# EAGLE design i2c-expander-40 (EAGLE 7.5.0)
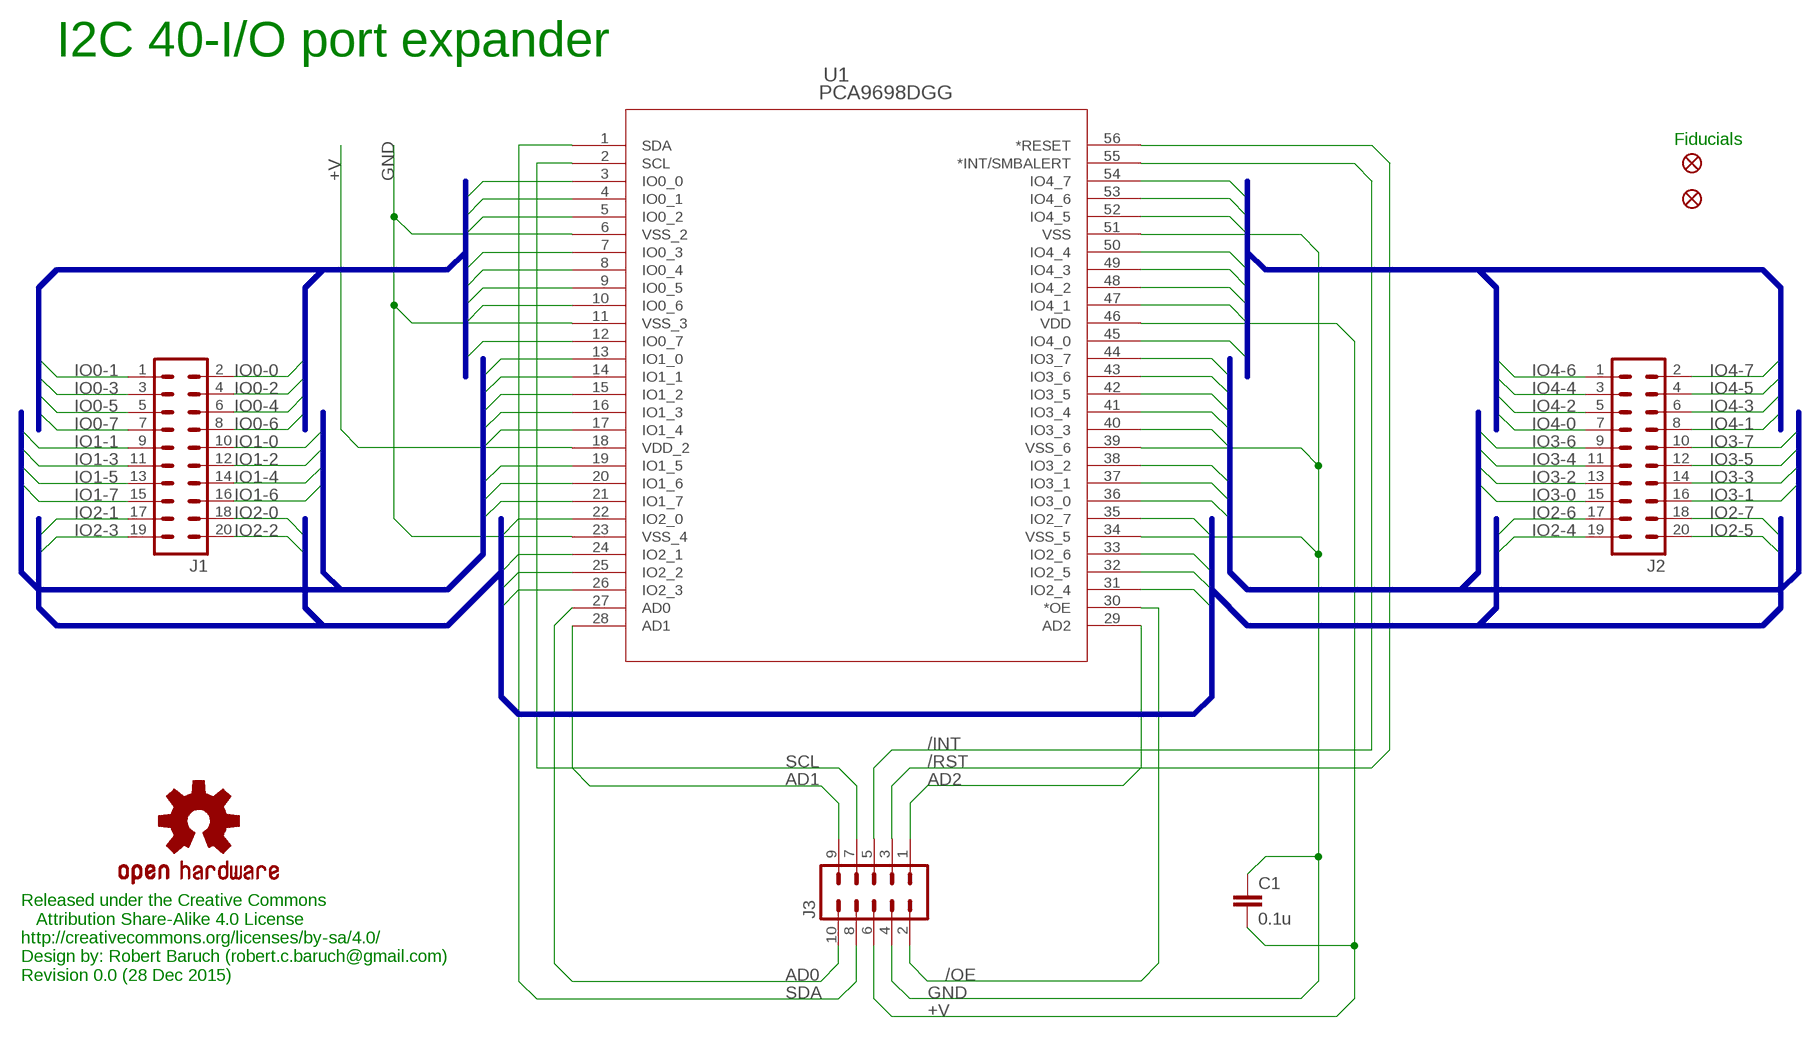
[diagram p0: schematic, sheet 1]

## Parts
C1  0.1u  C-EUC0805K  [C0805K]
FID1  FIDUCIAL1X2  [FIDUCIAL-1X2]
FID2  FIDUCIAL1X2  [FIDUCIAL-1X2]
J1  MA10-2  [MA10-2]
J2  MA10-2  [MA10-2]
J3  MA05-2  [MA05-2]
LOGO1  OSHW-LOGOS  [OSHW-LOGO-S]
U1  PCA9698DGG  [SOT364-1]

## Nets
+V: C1.2 J3.6 U1.18(VDD_2) U1.46(VDD)
/INT: J3.5 U1.55(*INT/SMBALERT)
/OE: J3.2 U1.30(*OE)
/RST: J3.3 U1.56(*RESET)
AD0: J3.10 U1.27(AD0)
AD1: J3.9 U1.28(AD1)
AD2: J3.1 U1.29(AD2)
GND: C1.1 J3.4 U1.6(VSS_2) U1.11(VSS_3) U1.23(VSS_4) U1.34(VSS_5) U1.39(VSS_6) U1.51(VSS)
IO0-0: J1.2 U1.3(IO0_0)
IO0-1: J1.1 U1.4(IO0_1)
IO0-2: J1.4 U1.5(IO0_2)
IO0-3: J1.3 U1.7(IO0_3)
IO0-4: J1.6 U1.8(IO0_4)
IO0-5: J1.5 U1.9(IO0_5)
IO0-6: J1.8 U1.10(IO0_6)
IO0-7: J1.7 U1.12(IO0_7)
IO1-0: J1.10 U1.13(IO1_0)
IO1-1: J1.9 U1.14(IO1_1)
IO1-2: J1.12 U1.15(IO1_2)
IO1-3: J1.11 U1.16(IO1_3)
IO1-4: J1.14 U1.17(IO1_4)
IO1-5: J1.13 U1.19(IO1_5)
IO1-6: J1.16 U1.20(IO1_6)
IO1-7: J1.15 U1.21(IO1_7)
IO2-0: J1.18 U1.22(IO2_0)
IO2-1: J1.17 U1.24(IO2_1)
IO2-2: J1.20 U1.25(IO2_2)
IO2-3: J1.19 U1.26(IO2_3)
IO2-4: J2.19 U1.31(IO2_4)
IO2-5: J2.20 U1.32(IO2_5)
IO2-6: J2.17 U1.33(IO2_6)
IO2-7: J2.18 U1.35(IO2_7)
IO3-0: J2.15 U1.36(IO3_0)
IO3-1: J2.16 U1.37(IO3_1)
IO3-2: J2.13 U1.38(IO3_2)
IO3-3: J2.14 U1.40(IO3_3)
IO3-4: J2.11 U1.41(IO3_4)
IO3-5: J2.12 U1.42(IO3_5)
IO3-6: J2.9 U1.43(IO3_6)
IO3-7: J2.10 U1.44(IO3_7)
IO4-0: J2.7 U1.45(IO4_0)
IO4-1: J2.8 U1.47(IO4_1)
IO4-2: J2.5 U1.48(IO4_2)
IO4-3: J2.6 U1.49(IO4_3)
IO4-4: J2.3 U1.50(IO4_4)
IO4-5: J2.4 U1.52(IO4_5)
IO4-6: J2.1 U1.53(IO4_6)
IO4-7: J2.2 U1.54(IO4_7)
SCL: J3.7 U1.2(SCL)
SDA: J3.8 U1.1(SDA)

## Buses
IO0-[0..7]
IO1-[0..7]
IO2-[0..7]
IO3-[0..7]
IO4-[0..7]

## Notes on the sheet
- I2C 40-I/O port expander
- Fiducials
- Released under the Creative Commons 
     Attribution Share-Alike 4.0 License
  http://creativecommons.org/licenses/by-sa/4.0/
  Design by: Robert Baruch (robert.c.baruch@gmail.com)
  Revision 0.0 (28 Dec 2015)

## Library data of the parts
C1 = rcl:C-EU: CAPACITOR, European symbol
FID1 FID2 = SparkFun-Aesthetics:FIDUCIAL: Fiducial Alignment Points Various fiducial points for machine vision alignment.
J1 J2 = con-lstb:MA10-2: PIN HEADER; OC_FARNELL: unknown; OC_NEWARK: unknown
J3 = con-lstb:MA05-2: PIN HEADER; OC_FARNELL: unknown; OC_NEWARK: unknown
LOGO1 = SparkFun-Aesthetics:OSHW-LOGO: Open Source Hardware Logo This logo indicates the piece of hardware it is found on incorporates a OSHW license and/or adheres to the definition of open source hardware found here: http://freedomdefined.org/OSHW
U1 = nxp:PCA9698DGG: I2C 40 I/O expander; COPYRIGHT: Copyright (C) 2015 Accelerated Designs. All rights reserved; MANUFACTURER_PART_NUMBER: PCA9698DGG; VENDOR: NXP

## Board
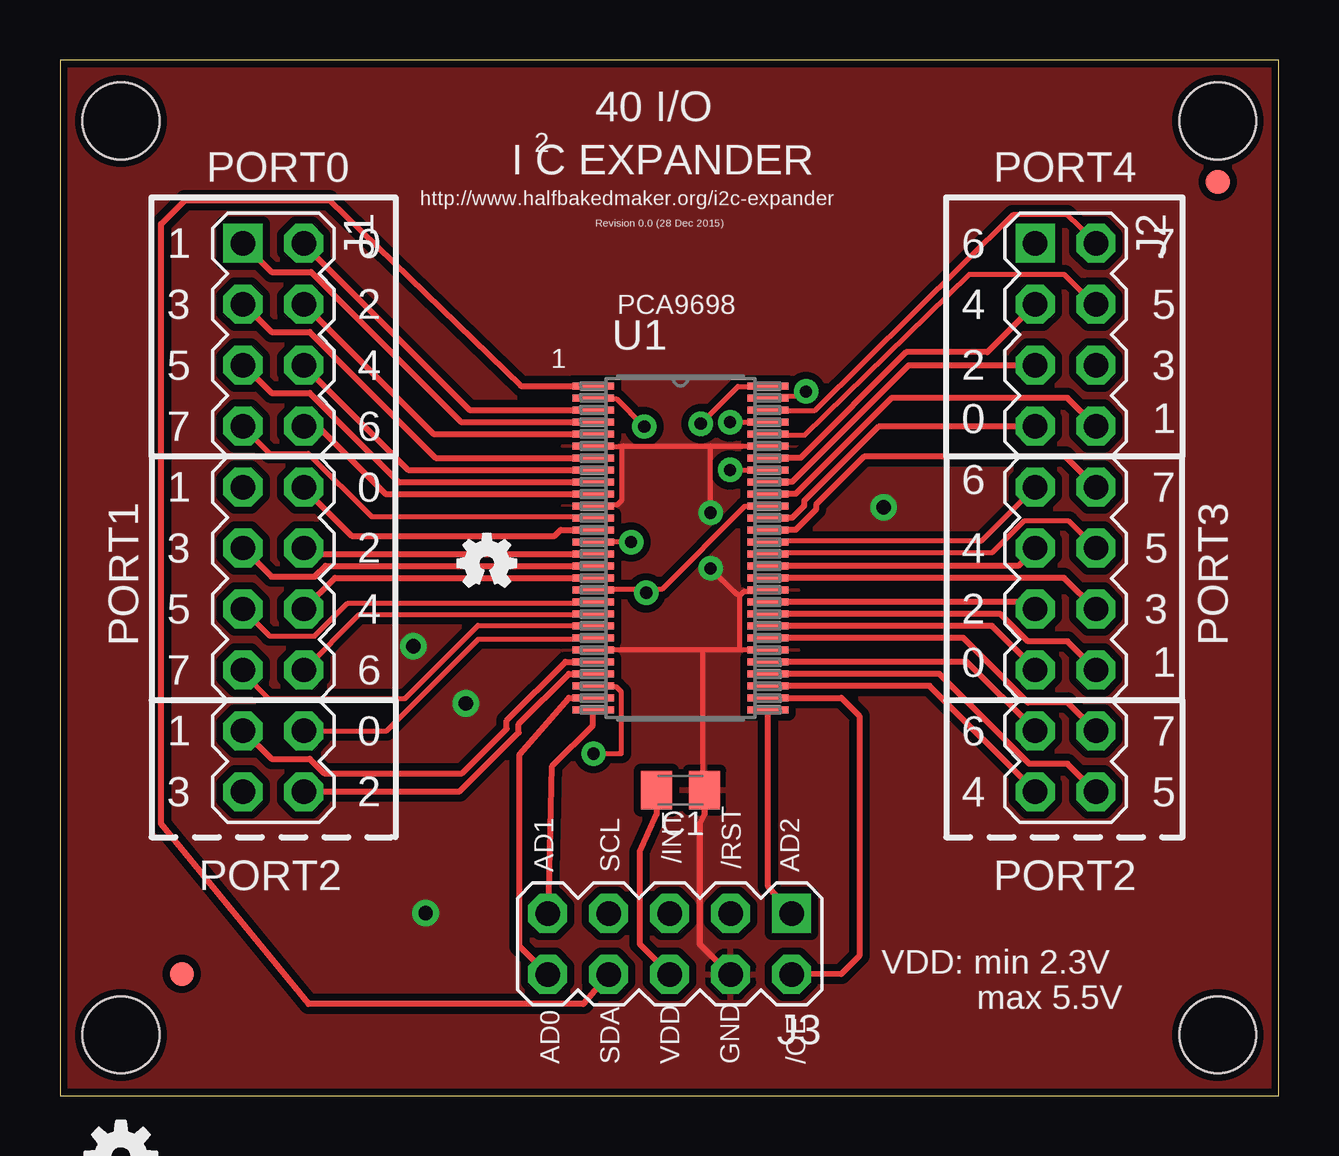
[diagram p1: board, top side]
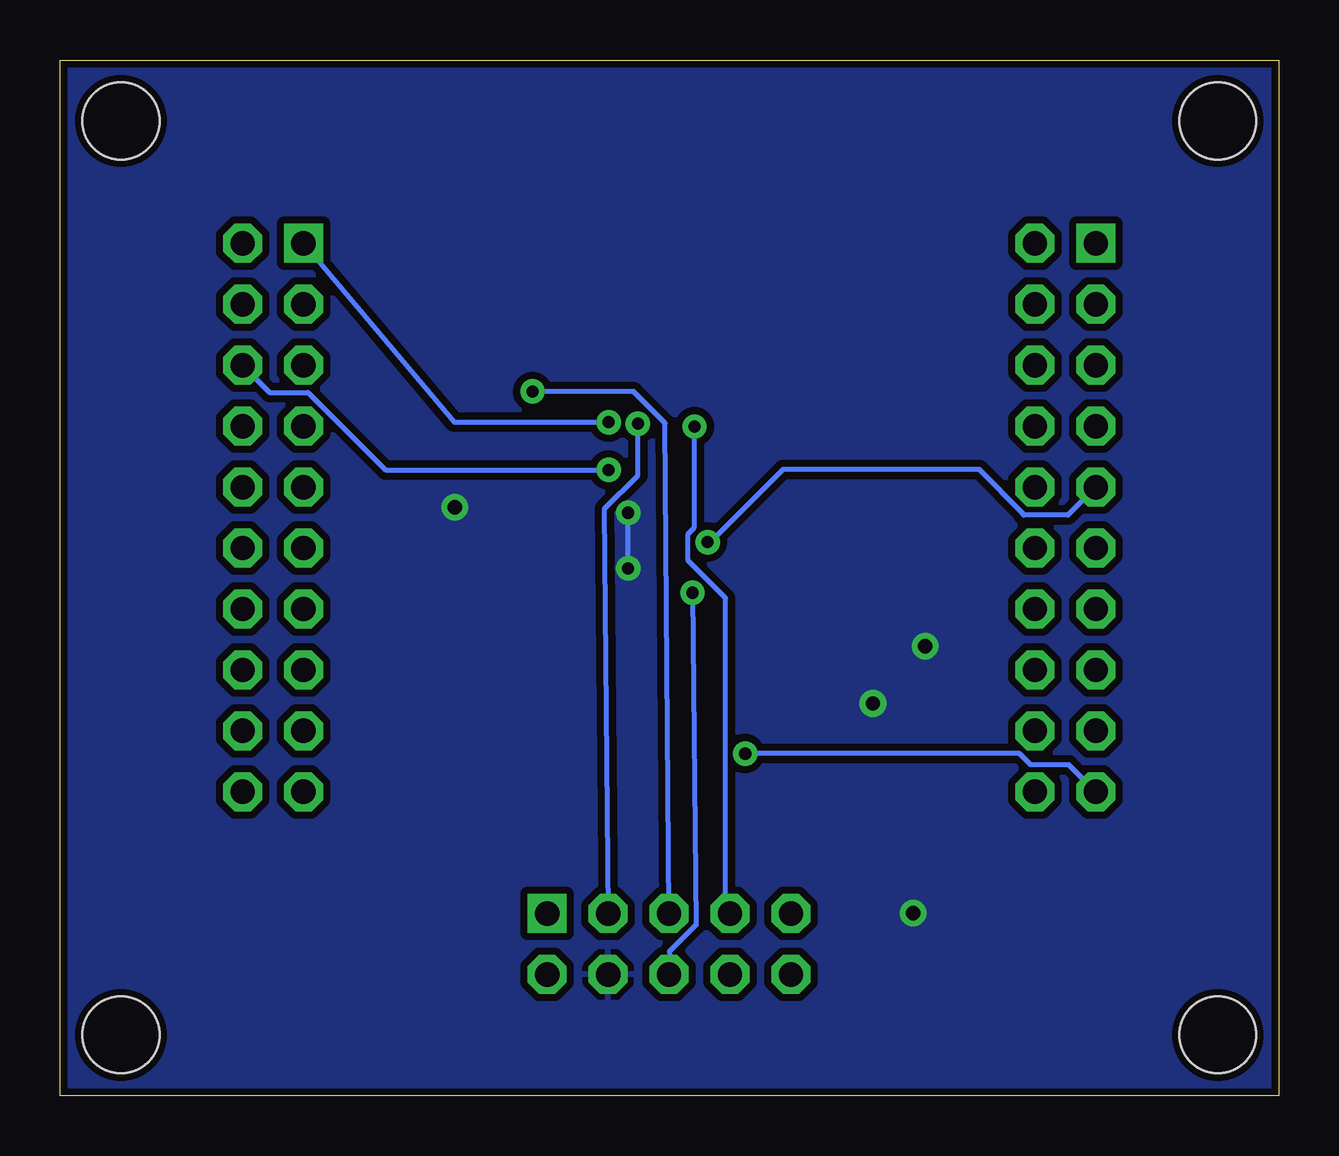
[diagram p2: board, bottom side, seen from below]

Size 50.8 x 43.18 mm. Coordinates in mm from the lower left corner, seen from the top.
Outline: 0,0 50.8,0 50.8,43.18 0,43.18 0,0
Copper layers (1*16): Top 0.035mm / dielectric 1.5mm / Bottom 0.035mm
Design rules "SparkFun": minimum track width 8mil, minimum drill 20mil, track to track 8mil, track to pad 8mil, pad to pad 8mil, via to via 8mil, smd to smd 8mil, copper to edge 10mil, drill to drill 8mil, minimum pad ring 12mil, minimum via ring 10mil, stop-mask expansion 4mil, vias tented up to drill 25mil, thermal gap 10mil
Holes 3.2 mm at 2.54,40.64 48.26,40.64 48.26,2.54 2.54,2.54

### Footprints (pad centres in the part's own frame; a part is rotated, then mirrored left to right if it is on the bottom)
C0805K = smd 1.3 x 1.6: 1 -1,0; 2 1,0
FIDUCIAL-1X2 = smd 1 x 1: 1 0,0
MA10-2 = drill 1.016 square: 1 -11.43,-1.27 | drill 1.016 octagon: 2 -11.43,1.27; 3 -8.89,-1.27; 4 -8.89,1.27; 5 -6.35,-1.27; 6 -6.35,1.27; 7 -3.81,-1.27; 8 -3.81,1.27; 9 -1.27,-1.27; 10 -1.27,1.27; 11 1.27,-1.27; 12 1.27,1.27; 13 3.81,-1.27; 14 3.81,1.27; 15 6.35,-1.27; 16 6.35,1.27; 17 8.89,-1.27; 18 8.89,1.27; 19 11.43,-1.27; 20 11.43,1.27
MA05-2 = drill 1.016 square: 1 -5.08,-1.27 | drill 1.016 octagon: 2 -5.08,1.27; 3 -2.54,-1.27; 4 -2.54,1.27; 5 0,-1.27; 6 0,1.27; 7 2.54,-1.27; 8 2.54,1.27; 9 5.08,-1.27; 10 5.08,1.27
SOT364-1 = smd 1.727 x 0.279: 1 -3.645,6.75; 2 -3.645,6.25; 3 -3.645,5.75; 4 -3.645,5.25; 5 -3.645,4.75; 6 -3.645,4.25; 7 -3.645,3.75; 8 -3.645,3.25; 9 -3.645,2.75; 10 -3.645,2.25; 11 -3.645,1.75; 12 -3.645,1.25; 13 -3.645,0.75; 14 -3.645,0.25; 15 -3.645,-0.25; 16 -3.645,-0.75; 17 -3.645,-1.25; 18 -3.645,-1.75; 19 -3.645,-2.25; 20 -3.645,-2.75; 21 -3.645,-3.25; 22 -3.645,-3.75; 23 -3.645,-4.25; 24 -3.645,-4.75; 25 -3.645,-5.25; 26 -3.645,-5.75; 27 -3.645,-6.25; 28 -3.645,-6.75; 29 3.645,-6.75; 30 3.645,-6.25; 31 3.645,-5.75; 32 3.645,-5.25; 33 3.645,-4.75; 34 3.645,-4.25; 35 3.645,-3.75; 36 3.645,-3.25; 37 3.645,-2.75; 38 3.645,-2.25; 39 3.645,-1.75; 40 3.645,-1.25; 41 3.645,-0.75; 42 3.645,-0.25; 43 3.645,0.25; 44 3.645,0.75; 45 3.645,1.25; 46 3.645,1.75; 47 3.645,2.25; 48 3.645,2.75; 49 3.645,3.25; 50 3.645,3.75; 51 3.645,4.25; 52 3.645,4.75; 53 3.645,5.25; 54 3.645,5.75; 55 3.645,6.25; 56 3.645,6.75

### Placement (x,y rotation side)
C1  25.87,12.74 180 top
FID1  5.08,5.08 0 top
FID2  48.26,38.1 0 top
J1  8.9,24.1 270 top
J2  41.92,24.1 270 top
J3  25.41,6.33 180 top
LOGO1  2.54,-2.54 0 top
U1  25.87,22.83 0 top
U$1  [OSHW-LOGO-MINI]  17.79,22.21 0 top

### Tracks (layer width: path | path; a pad name or v marks a point on that pad's centre or on a via)
+V  (via drill 0.51)
  Top 0.203: 24.43,21.11 25.09,21.11 28.54,24.57 29.49,24.57 U1.46 | 24.43,21.11 22.26,21.11 22.24,21.09 U1.18 | v24.43,20.97 24.43,21.11
  Top 0.254: C1.2 24.86,11.74 24.16,10.18 24.16,6.33 25.41,5.08 J3.6
  Bottom 0.203: v24.43,20.97 24.28,7.13 25.4,6.01 J3.6
/INT  (via drill 0.51)
  Top 0.203: v31.1,29.36 30.88,29.14 29.55,29.14 29.52,29.1 U1.55
  Bottom 0.203: v31.1,29.36 26.89,29.36 25.57,28.04 J3.5
/OE
  Top 0.254: U1.30 32.56,16.59 33.31,15.85 33.31,5.83 32.56,5.08 J3.2
/RST  (via drill 0.51)
  Top 0.203: v26.71,28.02 28.25,29.57 29.49,29.57 U1.56
  Bottom 0.203: v26.71,28.02 26.71,25.87 28.09,24.49 J3.3
AD0
  Top 0.254: J3.10 19.16,6.23 19.16,14.24 21.21,16.59 22.21,16.59 U1.27
AD1
  Top 0.254: U1.28 22.21,16.05 22.21,15.45 20.52,13.74 20.36,7.63 J3.9
AD2
  Top 0.254: J3.1 29.52,8.73 29.52,16.05 U1.29
GND  (via drill 0.51, 0.6)
  Top 0.203: 23.4,27.07 23.4,24.81 23.22,24.63 22.28,24.63 22.24,24.59 U1.11 | 23.4,27.07 22.24,27.07 U1.6 | 27.12,27.09 23.48,27.09 23.4,27.07 | 27.12,27.09 29.49,27.09 U1.51 | 28.34,18.59 29.49,18.59 U1.34 | 28.34,18.59 26.81,18.59 | 26.81,18.59 22.24,18.59 U1.23 | 28.34,20.85 28.52,21.03 29.45,21.03 29.49,21.07 U1.39 | 28.34,18.59 28.34,20.85 | 26.81,18.59 26.81,12.86 C1.1 | v27.12,24.3 27.12,27.09 | v27.12,21.99 28.19,20.91 28.25,20.91 28.34,20.85
  Top 0.254: C1.1 26.86,11.74 26.66,11.34 26.66,6.33 27.91,5.08 J3.4
  Bottom 0.203: v27.12,21.99 v27.12,24.3
  other vias: 15.24,7.62 16.92,16.36 14.73,18.75 34.34,24.54
  pour Top (isolate 0.305): 0,43.18 50.8,43.18 50.8,0 0,0
  pour Bottom (isolate 0.305): 0,43.18 50.8,43.18 50.8,0 0,0
IO0-0
  Top 0.254: U1.3 22.21,28.59 17.07,28.59 10.16,35.49 J1.2
IO0-1
  Top 0.254: J1.1 8.81,34.34 10.46,34.34 16.71,28.09 22.21,28.09 U1.4
IO0-2
  Top 0.254: J1.4 15.56,27.59 22.21,27.59 U1.5
IO0-3
  Top 0.254: U1.7 22.21,26.59 15.66,26.59 10.41,31.84 8.81,31.84 7.67,32.99 J1.3
IO0-4
  Top 0.254: U1.8 22.21,26.09 14.52,26.09 J1.6
IO0-5
  Top 0.254: U1.9 22.21,25.59 14.12,25.59 10.41,29.3 8.81,29.3 7.67,30.45 J1.5
IO0-6
  Top 0.254: U1.10 22.21,25.09 13.56,25.09 10.77,27.89 10.16,27.89 J1.8
IO0-7
  Top 0.203: U1.12 22.22,24.1 22.18,24.14 12.99,24.14 10.35,26.78 8.75,26.78 J1.7
IO1-0
  Top 0.254: U1.13 22.21,23.59 20.86,23.59 20.61,23.34 12.16,23.34 10.16,25.34 J1.10
IO1-1  (via drill 0.51)
  Top 0.203: v23.8,23.08 22.24,23.08 U1.14
  Bottom 0.203: v23.8,23.08 23.68,23.08 20.66,26.11 12.49,26.11 10.66,24.28 10.66,24.22 10.64,24.2 8.79,24.2 J1.9
IO1-2
  Top 0.254: U1.15 22.21,22.59 10.37,22.59 10.16,22.8 J1.12
IO1-3
  Top 0.254: J1.11 8.81,21.64 10.62,21.64 11.06,22.09 22.21,22.09 U1.16
IO1-4
  Top 0.254: J1.14 11.46,21.59 22.21,21.59 U1.17
IO1-5
  Top 0.203: U1.19 22.18,20.54 12,20.54 10.62,19.16 8.75,19.16 J1.13
IO1-6
  Top 0.203: U1.20 22.2,20.06 12.47,20.06 J1.16
IO1-7
  Top 0.203: U1.21 22.1,19.61 17.42,19.61 14.38,16.56 8.69,16.56 7.67,17.58 J1.15
IO2-0
  Top 0.203: U1.22 22.18,19.04 17.45,19.04 13.62,15.22 J1.18
IO2-1
  Top 0.254: U1.24 22.21,18.09 21.07,18.09 18.61,15.64 18.61,15.29 16.77,13.45 11.02,13.45 10.41,14.04 8.81,14.04 7.67,15.2 J1.17
IO2-2
  Top 0.254: U1.25 22.21,17.59 21.21,17.59 19.11,15.49 19.11,15.14 16.66,12.7 10.16,12.7 J1.20
IO2-3  (via drill 0.51)
  Top 0.203: v22.24,14.27 23.4,14.27 23.4,16.84 23.2,17.05 22.26,17.05 22.24,17.07 U1.26
  Bottom 0.203: v22.24,14.27 10.8,14.27 10.33,13.8 8.75,13.8 J1.19
IO2-4
  Top 0.254: U1.31 29.52,17.09 36.25,17.09 40.65,12.7 J2.19
IO2-5
  Top 0.254: U1.32 29.52,17.59 36.65,17.59 40.4,13.85 42,13.85 43.15,12.7 J2.20
IO2-6
  Top 0.254: U1.33 29.52,18.09 37.8,18.09 40.65,15.24 J2.17
IO2-7
  Top 0.254: U1.35 29.52,19.09 37.65,19.09 40.35,16.39 42,16.39 43.15,15.24 J2.18
IO3-0
  Top 0.254: U1.36 29.52,19.59 38.85,19.59 40.65,17.8 J2.15
IO3-1
  Top 0.254: J2.16 42,18.95 40.35,18.95 39.2,20.09 29.52,20.09 U1.37
IO3-2
  Top 0.254: J2.13 40.35,20.59 29.52,20.59 U1.38
IO3-3
  Top 0.254: U1.40 29.52,21.59 41.85,21.59 43.15,20.3 J2.14
IO3-4
  Top 0.254: U1.41 29.52,22.09 39.95,22.09 40.65,22.8 J2.11
IO3-5
  Top 0.203: U1.42 29.52,22.6 29.55,22.64 38.85,22.64 40.17,23.96 42.06,23.96 J2.12
IO3-6
  Top 0.203: U1.43 29.52,23.1 29.54,23.12 38.41,23.12 J2.9
IO3-7
  Top 0.254: U1.44 29.52,23.59 30.66,23.59 31.52,24.45 31.52,24.64 33.52,26.64 41.9,26.64 43.15,25.39 J2.10
IO4-0
  Top 0.254: U1.45 29.52,24.09 30.52,24.09 31.02,24.59 31.02,24.8 34.12,27.89 40.65,27.89 J2.7
IO4-1
  Top 0.254: U1.47 29.52,25.09 30.66,25.09 34.66,29.09 42,29.09 43.15,27.95 J2.8
IO4-2
  Top 0.254: U1.48 29.52,25.59 30.52,25.59 35.37,30.45 J2.5
IO4-3  (via drill 0.51)
  Top 0.203: v27.93,26.09 29.49,26.09 U1.49
  Bottom 0.203: v27.93,26.09 37.23,26.09 40.46,29.32 42.06,29.32 J2.6
IO4-4
  Top 0.254: J2.3 38.65,31 35.27,31 30.86,26.59 29.52,26.59 U1.50
IO4-5
  Top 0.203: U1.52 29.62,27.53 31.04,27.53 37.9,34.24 41.86,34.24 43.08,33.02 J2.4
IO4-6  (via drill 0.51)
  Top 0.203: v27.93,28.08 29.49,28.08 U1.53
  Bottom 0.203: v27.93,28.08 34.37,28.08 40.64,35.52 J2.1
IO4-7
  Top 0.203: U1.54 29.62,28.55 31.45,28.55 39.73,36.73 41.96,36.73 43.08,35.66 J2.2
SCL  (via drill 0.51)
  Top 0.203: v24.35,27.9 23.22,29.04 22.28,29.04 22.24,29.08 U1.2
  Bottom 0.203: v24.35,27.9 24.35,23.69 24.62,23.43 24.62,22.31 23.05,20.75 23.06,10.52 23.06,7.62 22.9,7.62 J3.7
SDA
  Top 0.254: J3.8 21.81,3.83 10.36,3.83 4.21,11.35 4.21,36.34 5.21,37.34 11.21,37.34 19.21,29.59 U1.1

### Text on the board
tPlace: 40 I/O | PORT0 | 2 | PORT4 | I C EXPANDER | http://www.halfbakedmaker.org/i2c-expander | Revision 0.0 (28 Dec 2015) | 1 | 0 | 6 | 7 | PCA9698 | 3 | 2 | 4 | 5 | 5 | 4 | 1 | 2 | 3 | 0 | 1 | 7 | 6 | PORT1 | 1 | 0 | 6 | 7 | PORT3 | 3 | 2 | 4 | 5 | 5 | 4 | 2 | 3 | 7 | 6 | 0 | 1 | 1 | 0 | 6 | 7 | 3 | 2 | /INT | /RST | 4 | 5 | PORT2 | PORT2 | AD1 | SCL | AD2 | VDD: min 2.3V | max 5.5V | AD0 | SDA | VDD | GND | /OE